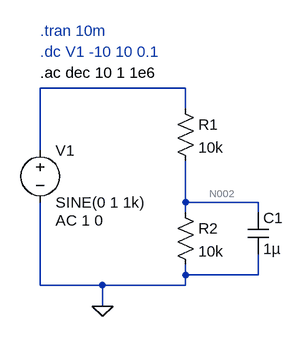
[diagram p0: schematic TestCircuit.asc]
TestCircuit.asc, the LTspice schematic file:
Version 4.1
SHEET 1 880 680
WIRE 336 64 112 64
WIRE 336 96 336 64
WIRE 112 160 112 64
WIRE 336 240 336 176
WIRE 448 240 336 240
WIRE 336 256 336 240
WIRE 448 256 448 240
WIRE 336 352 336 336
WIRE 448 352 448 320
WIRE 448 352 336 352
WIRE 112 368 112 240
WIRE 208 368 112 368
WIRE 336 368 336 352
WIRE 336 368 208 368
WIRE 208 400 208 368
FLAG 208 400 0
SYMBOL voltage 112 144 R0
WINDOW 123 24 124 Left 2
WINDOW 39 0 0 Left 0
SYMATTR InstName V1
SYMATTR Value SINE(0 1 1k)
SYMATTR Value2 AC 1 0
SYMBOL res 320 80 R0
SYMATTR InstName R1
SYMATTR Value 10k
SYMBOL res 320 240 R0
SYMATTR InstName R2
SYMATTR Value 10k
SYMBOL cap 432 256 R0
SYMATTR InstName C1
SYMATTR Value 1µ
TEXT 112 -24 Left 2 ;.tran 10m
TEXT 112 8 Left 2 ;.dc V1 -10 10 0.1
TEXT 112 40 Left 2 !.ac dec 10 1 1e6

The netlist it stands for:
* TestCircuit.asc
V1 N001 0 SINE(0 1 1k) AC 1 0
R1 N001 N002 10k
R2 N002 0 10k
C1 N002 0 1µ
* .tran 10m
* .dc V1 -10 10 0.1
.ac dec 10 1 1e6
.backanno
.end

* Results of the author's LTspice run, read from the files saved beside the schematic
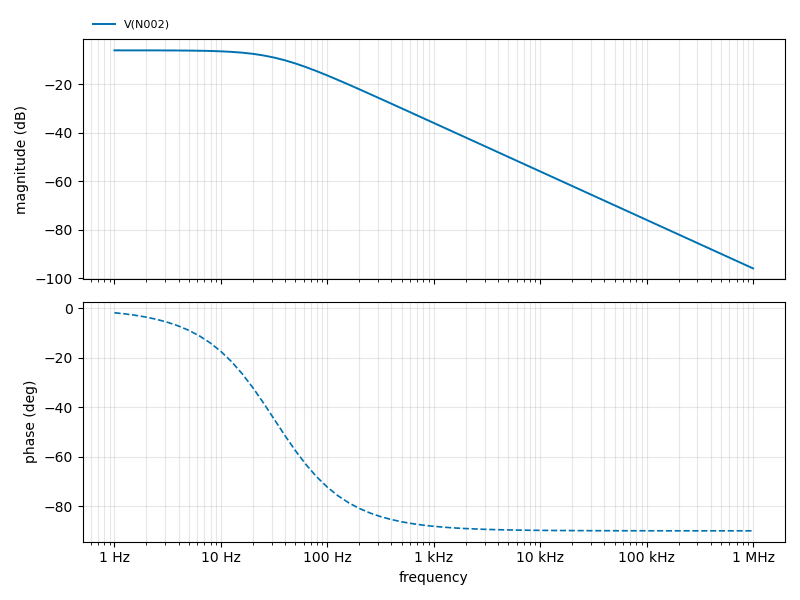
[diagram p1: AC Analysis of TestCircuit.asc, plotted from the saved traces]
* AC Analysis, 1 run:
*   V(N002): -6.02 dB at 1 Hz, -95.96 dB at 1 MHz, peak -6.02 dB at 1 Hz, 3 dB below the peak at 31.84 Hz